# EAGLE board nRF9160 Thing Plus (EAGLE 9.6.2)
REV: C
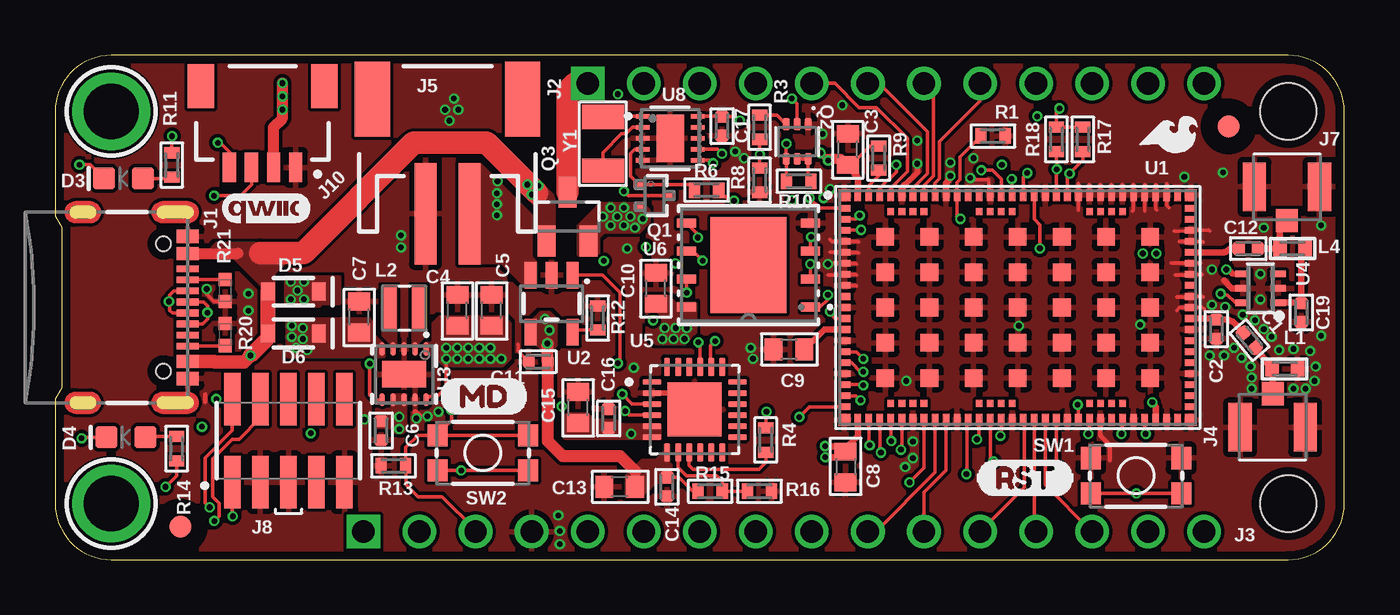
[diagram p3: board, top side]
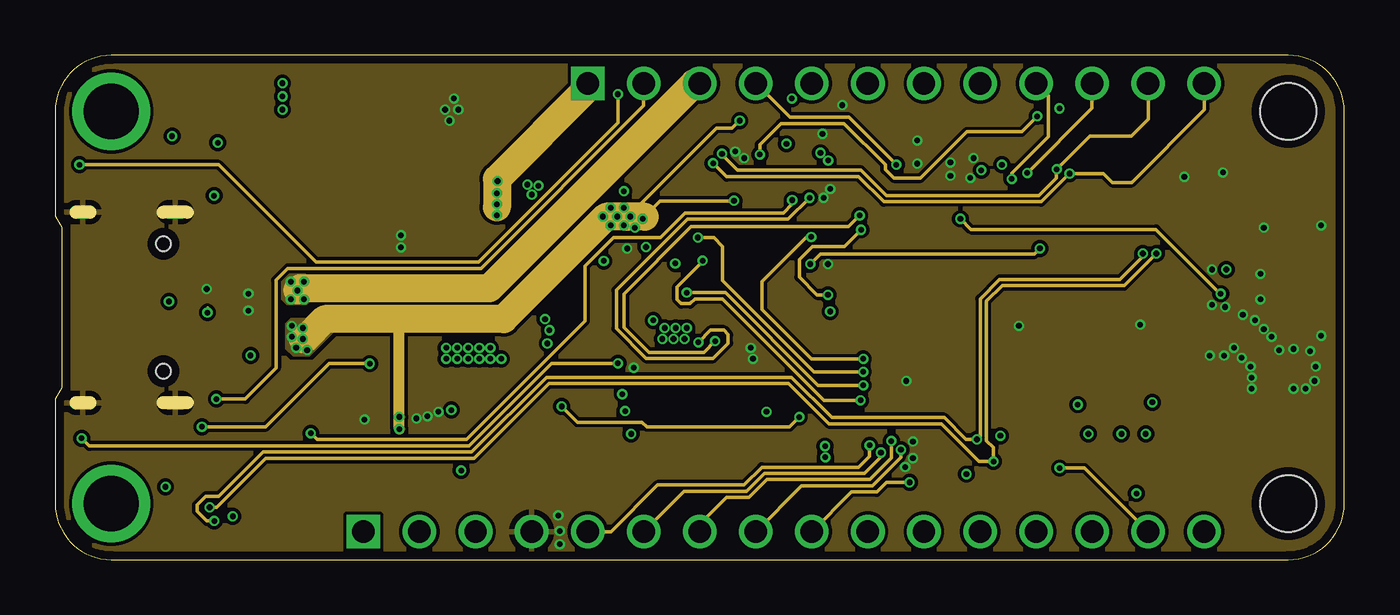
[diagram p4: board, inner layer Route2]
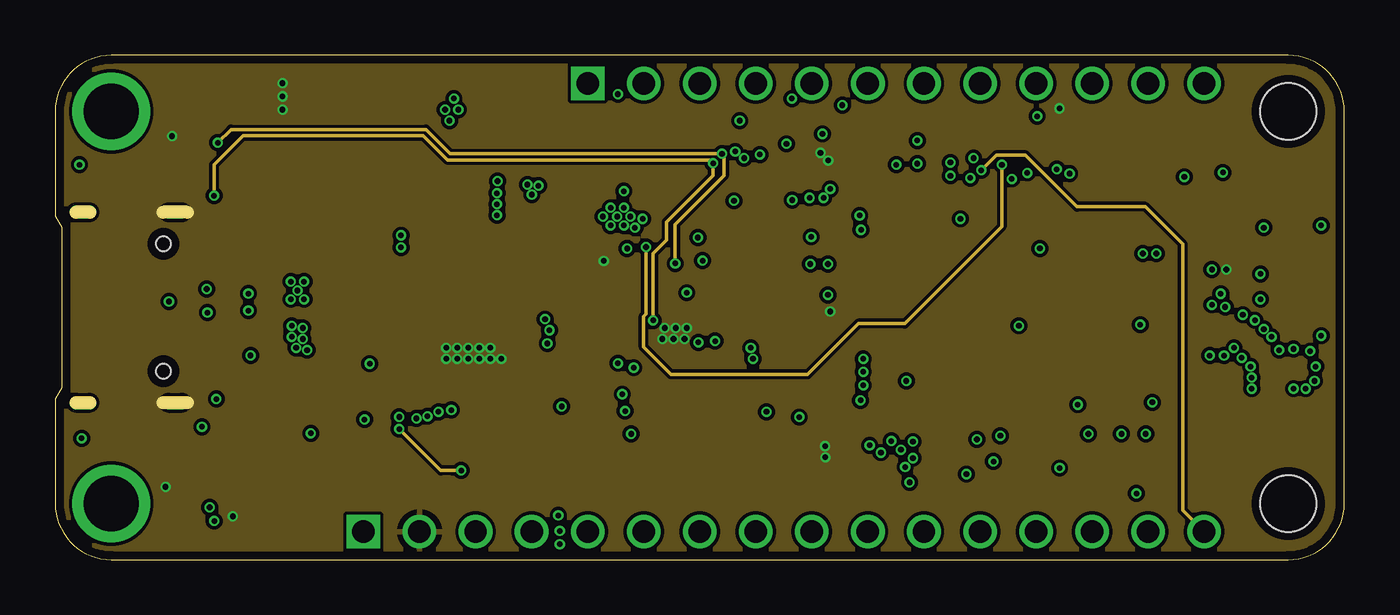
[diagram p5: board, inner layer Route15]
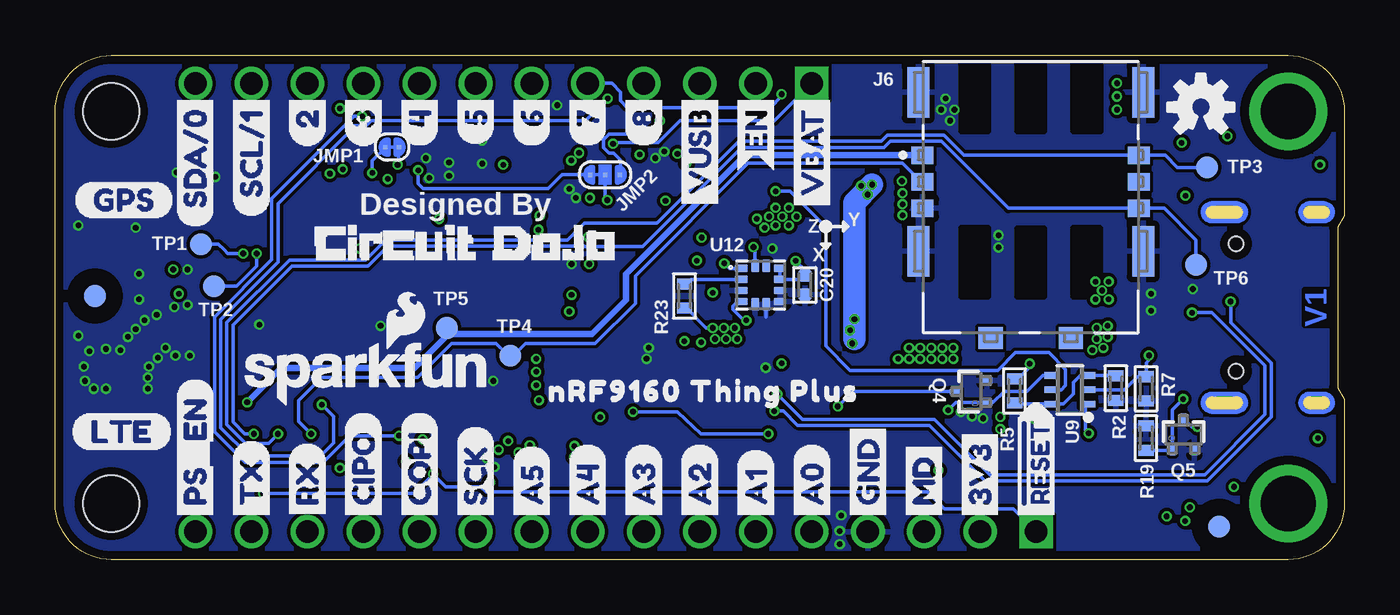
[diagram p6: board, bottom side, seen from below]

Size 58.42 x 22.86 mm. Coordinates in mm from the lower left corner, seen from the top.
Outline: 2.54,0 55.88,0 arc90 58.42,2.54 58.42,20.32 arc90 55.88,22.86 2.54,22.86 arc90 0,20.32 0,15.58 0.3,15.07 0.3,7.79 0,7.28 0,2.54 arc90 2.54,0
Copper layers (1*2*15*16): Top 0.035559375mm / dielectric 0.17018125mm / Route2 0.01778125mm / dielectric 47mil / Route15 0.01778125mm / dielectric 0.17018125mm / Bottom 0.035559375mm
Design rules "oshpark-4layer *": minimum track width 5mil, minimum drill 10mil, track to track 5mil, track to pad 5mil, pad to pad 5mil, via to via 5mil, smd to smd 5mil, copper to edge 15mil, drill to drill 6mil, minimum pad ring 4mil, minimum via ring 4mil, stop-mask expansion 2mil, vias tented up to drill 0.3mm, thermal gap 10mil
Net classes: 1 usb: width 0.15 mm; 2 rf: width 0.3 mm
Holes 2.54 mm at 55.88,20.32 55.88,2.54
tRestrict: area 28.6,5.3 to 29.4,5.5; area 27.5,6.4 to 27.7,7.2

## Footprints (pad centres in the part's own frame; a part is rotated, then mirrored left to right if it is on the bottom)
CAPC1005X55N = smd 0.54 x 0.6: 1 -0.43,0; 2 0.43,0
C0603 = smd 0.8 x 1: 1 -0.7,0; 2 0.7,0
LED-0603 = smd 1 x 1: A -0.877,0; C 0.877,0
SOD-323 = smd 0.63 x 0.83: A 1.15,0; C -1.15,0
USB-C-16P-2LAYER-PADS = smd 0.3 x 1: A5 -1.25,-0.34; A6 -0.25,-0.34; A7 0.25,-0.34; A8 1.25,-0.34; B5 1.75,-0.34; B6 0.75,-0.34; B7 -0.75,-0.34; B8 -1.75,-0.34 | smd 0.6 x 1: GND -3.225,-0.34; GND2 3.225,-0.34; VBUS1 -2.45,-0.34; VBUS2 2.45,-0.34 | drill 0.4 pad 0.6 long: SHLD1 -4.318,-0.915; SHLD2 4.318,-0.915; SHLD3 -4.318,-5.095; SHLD4 4.318,-5.095 | hole 0.65: -2.89,-1.445; 2.89,-1.445
CON-HEADER-1X12-MALE-PIN = drill 1.016 square: 1 0,0 | drill 1.016: 2 2.54,0; 3 5.08,0; 4 7.62,0; 5 10.16,0; 6 12.7,0; 7 15.24,0; 8 17.78,0; 9 20.32,0; 10 22.86,0; 11 25.4,0; 12 27.94,0
CON-HEADER-1X16-MALE-PIN = drill 1.016 square: 1 0,0 | drill 1.016: 2 2.54,0; 3 5.08,0; 4 7.62,0; 5 10.16,0; 6 12.7,0; 7 15.24,0; 8 17.78,0; 9 20.32,0; 10 22.86,0; 11 25.4,0; 12 27.94,0; 13 30.48,0; 14 33.02,0; 15 35.56,0; 16 38.1,0
TE_1909763-1 = smd 1 x 1.05: 1 0,-1.525 | smd 1.05 x 2.2: 2 -1.475,0; 3 1.475,0
JST-2-SMD = smd 1 x 4.6: 1 -1,-3.7; 2 1,-3.7 | smd 1.6 x 3.4: NC1 -3.4,1.5; NC2 3.4,1.5
MOLEX_104224-0820 = smd 1 x 2.3: G1 -5.1,1.5; G2 -5.1,8.7; G3 5.1,8.7; G4 5.1,1.5 | smd 1.1 x 1: R1 -1.82,12.625; R2 1.82,12.625 | smd 1 x 0.8: S1 4.9,4.35; S2 4.9,5.55; S3 -4.9,4.35; S4 4.9,6.75; S5 -4.9,5.55; S6 -4.9,6.75
SAMTEC_FTSH-105-XX-X-DV = smd 0.74 x 2.38: 1 -2.54,-1.88; 2 -2.54,1.88; 3 -1.27,-1.88; 4 -1.27,1.88; 5 0,-1.88; 6 0,1.88; 7 1.27,-1.88; 8 1.27,1.88; 9 2.54,-1.88; 10 2.54,1.88
JST04_1MM_RA = smd 0.6 x 1.35: 1 -1.5,0; 2 -0.5,0; 3 0.5,0; 4 1.5,0 | smd 1.2 x 2: NC1 2.8,-3.675; NC2 -2.8,-3.675
JUMPER-ROUND-NC = smd 0.2 x 0.2: P$1 -0.3,0; P$2 0.3,0
JUMPER-ROUND-3-NO-R = smd 0.2 x 0.2: P$1 -0.675,0; P$2 0,0; P$3 0.675,0
IND0402_22N_TAI = smd 0.61 x 0.711: 1 -0.572,0; 2 0.572,0
IND-2P0X2P0X1P2 = smd 0.65 x 2: P$1 -0.675,0; P$2 0.675,0
DIO_RB558WMF-L = smd 0.254 x 0.483: 1 -0.5,-0.711; 2 0.5,-0.711; 3 0,0.711
SOT50P160X60-6N = smd 0.56 x 0.32: 1 -0.785,0.5; 2 -0.785,0; 3 -0.785,-0.5; 4 0.785,-0.5; 5 0.785,0; 6 0.785,0.5
SOT23 = smd 0.8 x 1.4: 1 -0.95,-1.1; 2 0.95,-1.1; 3 0,1.1
R0402-M = smd 0.5 x 0.7: 1 -0.55,0; 2 0.55,0
0402-TIGHT = smd 0.6 x 0.6: 1 -0.5,0; 2 0.5,0
TACTILE_SWITCH_SMD_4.6X2.8MM = smd 0.9 x 1: 1 -2.05,-0.8; 2 2.05,-0.8; 3 2.05,0.8; 4 -2.05,0.8
TP-1P0 = smd 1 x 1: TP 0,0
NORDIC_NRF9160-SICA-R = smd 0.54 x 0.54: 1 -7.845,5.095; 21 -7.845,-5.095; 52 7.845,-5.095; 72 7.845,5.095 | smd 0.54 x 0.3: 2 -7.845,4.5; 3 -7.845,4; 4 -7.845,3.5; 5 -7.845,3; 6 -7.845,2.5; 7 -7.845,2; 8 -7.845,1.5; 9 -7.845,1; 10 -7.845,0.5; 11 -7.845,0; 12 -7.845,-0.5; 13 -7.845,-1; 14 -7.845,-1.5; 15 -7.845,-2; 16 -7.845,-2.5; 17 -7.845,-3; 18 -7.845,-3.5; 19 -7.845,-4; 20 -7.845,-4.5; 53 7.845,-4.5; 54 7.845,-4; 55 7.845,-3.5; 56 7.845,-3; 57 7.845,-2.5; 58 7.845,-2; 59 7.845,-1.5; 60 7.845,-1; 61 7.845,-0.5; 62 7.845,0; 63 7.845,0.5; 64 7.845,1; 65 7.845,1.5; 66 7.845,2; 67 7.845,2.5; 68 7.845,3; 69 7.845,3.5; 70 7.845,4; 71 7.845,4.5 | smd 0.3 x 0.54: 22 -7.25,-5.095; 23 -6.75,-5.095; 24 -6.25,-5.095; 25 -5.75,-5.095; 26 -5.25,-5.095; 27 -4.75,-5.095; 28 -4.25,-5.095; 29 -3.75,-5.095; 30 -3.25,-5.095; 31 -2.75,-5.095; 32 -2.25,-5.095; 33 -1.75,-5.095; 34 -1.25,-5.095; 35 -0.75,-5.095; 36 -0.25,-5.095; 37 0.25,-5.095; 38 0.75,-5.095; 39 1.25,-5.095; 40 1.75,-5.095; 41 2.25,-5.095; 42 2.75,-5.095; 43 3.25,-5.095; 44 3.75,-5.095; 45 4.25,-5.095; 46 4.75,-5.095; 47 5.25,-5.095; 48 5.75,-5.095; 49 6.25,-5.095; 50 6.75,-5.095; 51 7.25,-5.095; 73 7.25,5.095; 74 6.75,5.095; 75 6.25,5.095; 76 5.75,5.095; 77 5.25,5.095; 78 4.75,5.095; 79 4.25,5.095; 80 3.75,5.095; 81 3.25,5.095; 82 2.75,5.095; 83 2.25,5.095; 84 1.75,5.095; 85 1.25,5.095; 86 0.75,5.095; 87 0.25,5.095; 88 -0.25,5.095; 89 -0.75,5.095; 90 -1.25,5.095; 91 -1.75,5.095; 92 -2.25,5.095; 93 -2.75,5.095; 94 -3.25,5.095; 95 -3.75,5.095; 96 -4.25,5.095; 97 -4.75,5.095; 98 -5.25,5.095; 99 -5.75,5.095; 100 -6.25,5.095; 101 -6.75,5.095; 102 -7.25,5.095 | smd 0.8 x 0.8: 103_1 -6,3.2; 103_2 -4,3.2; 103_3 -2,3.2; 103_4 0,3.2; 103_5 2,3.2; 103_6 4,3.2; 103_7 6,3.2; 103_8 -6,1.6; 103_9 -4,1.6; 103_10 -2,1.6; 103_11 0,1.6; 103_12 2,1.6; 103_13 4,1.6; 103_14 6,1.6; 103_15 -6,0; 103_16 -4,0; 103_17 -2,0; 103_18 0,0; 103_19 2,0; 103_20 4,0; 103_21 6,0; 103_22 -6,-1.6; 103_23 -4,-1.6; 103_24 -2,-1.6; 103_25 0,-1.6; 103_26 2,-1.6; 103_27 4,-1.6; 103_28 6,-1.6; 103_29 -6,-3.2; 103_30 -4,-3.2; 103_31 -2,-3.2; 103_32 0,-3.2; 103_33 2,-3.2; 103_34 4,-3.2; 103_35 6,-3.2 | smd 0.3 x 0.3: 104 -5.75,-4.35; 105 -5.25,-4.35; 106 -4.75,-4.35; 107 -4.25,-4.35; 108 -1.75,-4.35; 109 -1.25,-4.35; 110 -0.75,-4.35; 111 -0.25,-4.35; 112 3.25,-4.35; 113 3.75,-4.35; 114 4.25,-4.35; 115 4.75,-4.35; 116 4.75,4.35; 117 4.25,4.35; 118 3.75,4.35; 119 3.25,4.35; 120 -0.25,4.35; 121 -0.75,4.35; 122 -1.25,4.35; 123 -1.75,4.35; 124 -4.25,4.35; 125 -4.75,4.35; 126 -5.25,4.35; 127 -5.75,4.35
SOT23-5 = smd 0.55 x 1.2: 1 -0.95,-1.3; 2 0,-1.3; 3 0.95,-1.3; 4 0.95,1.3; 5 -0.95,1.3
DSK0010A = smd 0.6 x 0.25: 1 -1.15,1; 2 -1.15,0.5; 3 -1.15,0; 4 -1.15,-0.5; 5 -1.15,-1; 6 1.15,-1; 7 1.15,-0.5; 8 1.15,0; 9 1.15,0.5; 10 1.15,1 | smd 1.2 x 2: 11 0,0
SOT363 = smd 0.3 x 0.7: 1 -0.65,-0.8; 2 0,-0.8; 3 0.65,-0.8; 4 0.65,0.8; 5 0,0.8; 6 -0.65,0.8
QFN50P400X400X80-25N = smd 0.84 x 0.26: 1 -1.935,1.25; 2 -1.935,0.75; 3 -1.935,0.25; 4 -1.935,-0.25; 5 -1.935,-0.75; 6 -1.935,-1.25; 13 1.935,-1.25; 14 1.935,-0.75; 15 1.935,-0.25; 16 1.935,0.25; 17 1.935,0.75; 18 1.935,1.25 | smd 0.26 x 0.84: 7 -1.25,-1.935; 8 -0.75,-1.935; 9 -0.25,-1.935; 10 0.25,-1.935; 11 0.75,-1.935; 12 1.25,-1.935; 19 1.25,1.935; 20 0.75,1.935; 21 0.25,1.935; 22 -0.25,1.935; 23 -0.75,1.935; 24 -1.25,1.935 | smd 2.45 x 2.45: 25 0,0
WIN_ZP-8-L = smd 0.86 x 0.403: 1 -2.818,1.905; 2 -2.818,0.635; 3 -2.818,-0.635; 4 -2.818,-1.905; 5 2.818,-1.905; 6 2.818,-0.635; 7 2.818,0.635; 8 2.818,1.905 | smd 3.454 x 4.343: 9 0,0
DFN10_2P7X2P7-L = smd 0.61 x 0.203: 1 -1.245,1; 2 -1.245,0.5; 3 -1.245,0; 4 -1.245,-0.5; 5 -1.245,-1; 6 1.245,-1; 7 1.245,-0.5; 8 1.245,0; 9 1.245,0.5; 10 1.245,1 | smd 1.245 x 2.159: 11 0,0
PQFN50P200X200100-12N = smd 0.575 x 0.35: 1 -0.875,0.75; 2 -0.875,0.25; 3 -0.875,-0.25; 4 -0.875,-0.75; 7 0.875,-0.75; 8 0.875,-0.25; 9 0.875,0.25; 10 0.875,0.75 | smd 0.35 x 0.575: 5 -0.25,-0.875; 6 0.25,-0.875; 11 0.25,0.875; 12 -0.25,0.875
FIDUCIAL-1MM = smd 1 x 1: 1 0,0
MOUNTING-HOLE-2.5MM-PLATED = drill 2.5 pad 3.2: P$1 0,0
XTAL320X150X90 = smd 1.092 x 1.905: 1 -1.219,0; 2 1.219,0

## Placement (x,y rotation side)
C1  15p  [CAPC1005X55N]  54.12,9.95 130 top
C2  15p  [CAPC1005X55N]  52.62,10.45 270 top
C3  4.7u  [C0603]  35.92,18.6 90 top
C4  10u  [C0603]  18.23,11.3 90 top
C5  10u  [C0603]  19.78,11.3 90 top
C6  0.1u  [CAPC1005X55N]  14.77,5.85 270 top
C7  10u  [C0603]  13.78,11 90 top
C8  4.7u  [C0603]  35.82,4.2 270 top
C9  4.7u  [C0603]  33.25,9.53 180 top
C10  4.7u  [C0603]  27.22,12.3 90 top
C11  1u  [CAPC1005X55N]  21.89,8.97 180 top
C12  56p  [CAPC1005X55N]  54.07,14.1 0 top
C13  4.7u  [C0603]  25.58,3.3 180 top
C14  0.1u  [CAPC1005X55N]  27.72,3.3 270 top
C15  4.7u  [C0603]  23.7,6.9 90 top
C16  0.1u  [CAPC1005X55N]  25.08,6.4 90 top
C17  0.1u  [CAPC1005X55N]  30.22,19.65 270 top
C19  56p  [CAPC1005X55N]  56.47,11.2 270 top
C20  0.1u  [CAPC1005X55N]  24.45,12.45 270 bottom
D3  BLUE  [LED-0603]  3.1,17.28 180 top
D4  Yellow  [LED-0603]  3.2,5.55 180 top
D5  1A/23V/620mV  [SOD-323]  10.8,12.15 180 top
D6  1A/23V/620mV  [SOD-323]  10.8,10.25 180 top
J1  USB Female C  [USB-C-16P-2LAYER-PADS]  6.35,11.43 270 top
J2  CON-HEADER-1X12-MALE-PIN  [CON-HEADER-1X12-MALE-PIN]  24.13,21.59 0 top
J3  CON-HEADER-1X16-MALE-PIN  [CON-HEADER-1X16-MALE-PIN]  13.97,1.27 0 top
J4  CON-1909763-1  [TE_1909763-1]  55.17,6 180 top
J5  [JST-2-SMD]  17.78,19.38 0 top
J6  CON-SIM-104224-0820  [MOLEX_104224-0820]  14.21,22.68 180 bottom
J7  CON-1909763-1  [TE_1909763-1]  55.82,16.9 0 top
J8  CON-FTSH-105-XX-X-DV  [SAMTEC_FTSH-105-XX-X-DV]  10.57,5.39 0 top
J10  QWIIC_RIGHT_ANGLE  [JST04_1MM_RA]  9.4,17.78 180 top
JMP1  JUMPER-NC  [JUMPER-ROUND-NC]  43.15,18.7 180 bottom
JMP2  JUMPER-3/1  [JUMPER-ROUND-3-NO-R]  33.5,17.45 180 bottom
L1  39n  [IND0402_22N_TAI]  55.72,8.65 180 top
L2  1.5u  [IND-2P0X2P0X1P2]  15.82,11.4 0 top
L4  68n  [IND0402_22N_TAI]  56.07,14.1 180 top
LOGO5  OSHW-LOGOS  [OSHW-LOGO-S]  6.5,20.52 0 bottom
PCB1  PCB-NRF91-FEATHER  [PLACEHOLDER]  -12.93,-5.08 0 top  (outside the outline)
Q1  MOSFET-P-SC89  [DIO_RB558WMF-L]  27.17,16.5 270 top
Q2  MOSFET-DUAL-COMP-SOT563  [SOT50P160X60-6N]  33.62,18.95 270 top
Q3  MOSFET-P-20V-4.7A-SOT23  [SOT23]  23.22,15.55 0 top
Q4  MOSFET-N-SC89  [DIO_RB558WMF-L]  16.91,7.62 90 bottom
Q5  MOSFET-N-SC89  [DIO_RB558WMF-L]  7.29,5.68 0 bottom
R1  100k  [R0402-M]  42.5,19.2 180 top
R2  1M  [R0402-M]  10.36,7.77 90 bottom
R3  100k  [R0402-M]  31.92,19.6 90 top
R4  1k  [R0402-M]  32.2,5.42 90 top
R5  100k  [R0402-M]  14.95,7.65 270 bottom
R6  100k  [R0402-M]  29.52,16.75 0 top
R7  100k  [R0402-M]  8.98,7.74 90 bottom
R8  100k  [R0402-M]  31.92,17.2 90 top
R9  1M  [R0402-M]  37.32,18.2 90 top
R10  100k  [R0402-M]  33.7,17.15 180 top
R11  330  [R0402-M]  5.28,17.89 90 top
R12  2k  [R0402-M]  24.58,10.95 270 top
R13  100k  [R0402-M]  15.33,4.25 0 top
R14  330  [R0402-M]  5.51,5.03 270 top
R15  22k  [R0402-M]  29.68,3.1 180 top
R16  33k  [R0402-M]  31.92,3.1 180 top
R17  10k  [R0402-M]  46.57,19.05 90 top
R18  10k  [R0402-M]  45.37,19.05 90 top
R19  1M  [R0402-M]  8.99,5.5 270 bottom
R20  5.1k  [0402-TIGHT]  7.7,10.2 270 top
R21  5.1k  [0402-TIGHT]  7.7,12.2 90 top
R23  100k  [R0402-M]  29.9,11.95 270 bottom
SW1  MOMENTARY-SWITCH-SPST-SMD-4.6X2.8MM  [TACTILE_SWITCH_SMD_4.6X2.8MM]  48.98,3.8 0 top
SW2  MOMENTARY-SWITCH-SPST-SMD-4.6X2.8MM  [TACTILE_SWITCH_SMD_4.6X2.8MM]  19.38,4.84 0 top
TP1  TP-1SIDE-1P0  [TP-1P0]  51.82,14.3 0 bottom
TP2  TP-1SIDE-1P0  [TP-1P0]  51.22,12.4 0 bottom
TP3  TP-1SIDE-1P0  [TP-1P0]  6.23,17.78 0 bottom
TP4  TP-1SIDE-1P0  [TP-1P0]  37.8,9.24 0 bottom
TP5  TP-1SIDE-1P0  [TP-1P0]  40.67,10.5 0 bottom
TP6  TP-1SIDE-1P0  [TP-1P0]  6.72,13.37 270 bottom
U1  MOD-NRF9160-SICA-R  [NORDIC_NRF9160-SICA-R]  43.62,11.43 0 top
U2  MCP73831  [SOT23-5]  22.5,11.6 180 top
U3  IC-TPS63031DSKR  [DSK0010A]  15.82,8.4 270 top
U4  POWER-SWITCH-MIC94092YC6  [SOT363]  54.62,12.3 90 top
U5  IC-CP2102N-A02-GQFN24R  [QFN50P400X400X80-25N]  28.98,6.8 0 top
U6  FLASH-WSON  [WIN_ZP-8-L]  31.42,13.35 180 top
U8  IC-PCF85063ATL/1  [DFN10_2P7X2P7-L]  27.87,19.1 0 top
U9  IC-BAV70S  [SOT363]  12.44,7.7 90 bottom
U12  IC-LIS2DH12TR  [PQFN50P200X200100-12N]  26.45,12.45 0 bottom
U$1  [SFE_LOGO_NAME_FLAME_.1]  44.27,8.44 0 bottom
U$2  [LOGO-CIRCUITDOJO]  46.9,13.19 0 bottom
U$3  FIDUCIAL-1MM  [FIDUCIAL-1MM]  56.62,11.95 0 bottom
U$4  FIDUCIAL-1MM  [FIDUCIAL-1MM]  5.67,1.5 0 bottom
U$5  [A3L-LOC]  -164.72,-120.13 0 top  (outside the outline)
U$6  [QWIIC_4MM]  9.57,15.92 0 top
U$7  [RST0]  41.7,3.7 0 top
U$8  [PS_EN0]  52.07,1.55 90 bottom
U$9  [MD0]  17.4,7.4 0 top
U$10  [20]  46.99,18.66 90 bottom
U$11  [30]  44.45,18.66 90 bottom
U$12  [SCL#11]  49.53,15.52 90 bottom
U$13  [SDA#00]  52.07,15.04 90 bottom
U$14  [MD0]  19.05,1.55 90 bottom
U$15  [SFE_LOGO_FLAME_.1]  50.65,19.15 315 top
U$16  [TX0]  49.53,1.55 90 bottom
U$17  [RX0]  46.99,1.55 90 bottom
U$18  [SCK0]  39.37,1.55 90 bottom
U$19  [CIPO0]  44.45,1.55 90 bottom
U$20  [COPI0]  41.91,1.55 90 bottom
U$21  [GPS0]  57.6,16.3 0 bottom
U$22  [LTE0]  57.7,5.8 0 bottom
U$23  [NRF9160_THING_PLUS0]  29.03,7.64 0 bottom
U$24  FIDUCIAL-1MM  [FIDUCIAL-1MM]  5.67,1.5 0 top
U$31  MOUNTING-HOLE-2.5MM-PLATED  [MOUNTING-HOLE-2.5MM-PLATED]  2.54,20.32 270 top
U$32  MOUNTING-HOLE-2.5MM-PLATED  [MOUNTING-HOLE-2.5MM-PLATED]  2.54,2.54 270 top
U$35  FIDUCIAL-1MM  [FIDUCIAL-1MM]  53.17,19.63 270 top
U$69  [GND12]  21.59,1.55 90 bottom
U$71  [3V314]  16.51,1.51 90 bottom
U$72  [#RESET15]  13.97,1.4 90 bottom
U$73  [VUSB25]  29.21,15.63 90 bottom
U$74  [EN26]  26.67,17.58 90 bottom
U$75  [VBAT27]  24.13,15.58 90 bottom
U$83  [A56]  36.83,1.55 90 bottom
U$84  [A47]  34.29,1.56 90 bottom
U$85  [A38]  31.75,1.52 90 bottom
U$86  [A29]  29.21,1.51 90 bottom
U$87  [A110]  26.67,1.56 90 bottom
U$88  [A011]  24.13,1.51 90 bottom
U$89  [412]  41.91,18.66 90 bottom
U$90  [513]  39.37,18.75 90 bottom
U$91  [614]  36.83,18.7 90 bottom
U$92  [715]  34.29,18.7 90 bottom
U$93  [816]  31.75,18.71 90 bottom
Y1  XTAL-ABS07AIG-32.768KHZ-7-T  [XTAL320X150X90]  24.82,18.85 90 top

## Tracks (layer width: path | path; a pad name or v marks a point on that pad's centre or on a via)
!EN  (via drill 0.25)
  Route2 0.152: J2.2 26.67,20.57 19.3,13.2 10.54,13.2 10.01,12.67 10.01,8.68 8.61,7.28 v7.3,7.28
  Bottom 0.152: R19.2 7.8,4.96 Q5.1 7.79,6.79 v7.3,7.28
!RESET  (via drill 0.25)
  Top 0.152: U1.32 41.32,6.38 41.32,3.9 v41.3,3.88 | SW1.1 v49,3 SW1.2
  Bottom 0.152: J3.1 15.01,2.31 18.13,2.31 18.9,3.08 38.53,3.08 38.54,3.07 38.9,3.07 39.14,3.31 40.73,3.31 v41.3,3.88 42.17,3 48.98,3 v48.99,3 v49,3
+3V3  (via drill 0.25)
  Top 0.152: C3.1 36.02,17.85 36.92,18.75 R9.2 | 5.43,18.59 R11.2 5.28,19.18 v5.3,19.2 | U1.12 35.34,10.93 35.12,11.15 v35.12,11.25 | R17.2 R18.2 45.37,20.31 v45.51,20.45 | R14.2 5.51,3.81 v5,3.3 | U3.10 16.97,7.4 17.3,7.4 17.72,7.82 v17.72,9.1 | J8.1 8.03,1.98 v8.05,1.96
  Top 0.203: C8.1 35.84,5.08
  Top 0.254: v53.07,13.15 53.17,13.15 53.37,12.95 U4.4
  Top 0.305: U1.102 36.37,17.3 C3.1 35.41,18.09 v35.03,18.09 | v34.68,18.44 34.87,18.25 35.62,18.25 36.02,17.85 | v34.89,5.14 35.58,5.14 C8.1 35.56,4.64 v34.9,4.64 | U1.22 36.37,5.6 35.84,5.08
  Top 0.508: J10.2 9.9,19.6 10.3,20 v10.3,20.4 v10.3,21 v10.3,21.6
  Bottom 0.152: U12.10 U12.9 24.63,12.7 C20.1 24.45,13.13 v24.86,13.54 | v28.62,10.5 28.92,10.5 29.82,11.4 R23.2
  other vias: 18.72,9.1 18.22,9.1 18.72,9.6 19.22,9.6 19.22,9.1 19.72,9.1 19.72,9.6 20.22,9.1 27.62,10.5 28.12,10.5 28.52,10 28.02,10 27.52,10 18.22,9.6 17.72,9.6
  pour Top (no thermals): 17.12,9.3 16.82,9.3 16.82,9.8 17.02,9.8 17.12,9.9 17.12,10.7 17.42,11 20.32,11 20.62,10.7 20.62,9.12 20.3,8.8 17.62,8.8
  pour Route15 (isolate 0.152, rank 2): 58.42,0 0,0 0,22.86 58.42,22.86
  pour Top (no thermals): 26.82,11.9 26.82,10.2 27.22,9.8 28.52,9.8 29.02,10.3 29.02,11.6 28.12,11.6 27.82,11.9
ANT
  Top 0.3: U1.61 52.57,10.93 C2.1 53.02,10.88 arc-49 53.5,10.66 arc3 C1.2
ANT_FILT
  Top 0.3: C1.1 55.05,8.75 L1.2 55.17,8.65 J4.1
CHRG  (via drill 0.25)
  Top 0.152: U2.1 24.8,12.9 25.6,12.1 25.6,9 v25.5,8.9 | v1.2,5.5 1.25,5.55 D4.C
  Route2 0.152: v25.5,8.9 22.5,8.9 18.75,5.15 1.55,5.15 v1.2,5.5 1.41,5.29
COEX0/LNA_EN  (via drill 0.25)
  Top 0.152: v41.02,15.45 40.87,15.45 U1.93 40.87,17.09 41,17.22 41,18.25 R1.2 | U4.6 53.47,11.65 53.12,12 52.82,12 v52.82,12.05
  Route2 0.152: v41.02,15.45 41.5,14.97 49.88,14.97 52.8,12.05 v52.82,12.05
CP212_VBUS
  Top 0.152: U5.8 28.23,4.17 28.6,3.8 30,3.8 30.23,3.57 R15.1 R16.2
CP2102N-!RST
  Top 0.152: R4.1 32.2,4.4 31.9,4.1 28.9,4.1 28.73,4.27 U5.9
CP2102N-VDD  (via drill 0.25)
  Top 0.152: R4.2 32.2,6.7 v32.23,6.7
  Bottom 0.152: v26.1,5.7 29.15,5.7 30.21,6.69 v32.22,6.69 v32.23,6.7
  pour Top (no thermals): 27.4,6.1 25.6,6.1 25.4,6.3 24.4,6.3 24.1,6.6 23.1,6.6 23.1,5.5 27.4,5.5
DIFF_N  (via drill 0.25)
  Top 0.152: J1.B7 5.38,12.18 5.2,12 5.2,11.7 | 5.2,11.7 5.2,11.3 5.32,11.18 J1.A7 | 5.2,11.7 v5.15,11.7 | U5.4 26.01,6.55 v25.83,6.74
  Bottom 0.152: v25.83,6.74 25.43,6.74 24.78,6.09 18.8,6.09 16.29,3.57 6.21,3.57 3.32,6.46 3.32,8.92 5.15,10.75 v5.15,11.7
DIFF_P  (via drill 0.25)
  Top 0.152: J1.A6 6.72,11.68 6.9,11.5 v6.9,11.2 6.9,10.9 6.68,10.68 J1.B6 | U5.3 26.15,7.05 v25.7,7.5
  Route2 0.152: v6.9,11.2 6.9,11.4
  Bottom 0.152: v25.7,7.5 24.57,6.37 18.59,6.37 16.07,3.85 6.33,3.85 3.6,6.58 3.6,8.8 6,11.2 v6.9,11.2
FLASH_CS  (via drill 0.25)
  Top 0.152: U1.4 36.5,14.93 v36.52,14.95 | v35.02,12 35.02,11.8 34.66,11.45 U6.1
  Route2 0.152: v36.52,14.95 35.77,14.2 34.32,14.2 33.72,13.6 33.72,12.8 34.52,12 v35.02,12
FLASH_HOLD  (via drill 0.25)
  Top 0.152: U1.18 36.59,7.93 v36.62,7.9 | U6.7 28.6,12.12 v28.62,12.1
  Route2 0.152: v36.62,7.9 34.57,7.9 30.37,12.1 v28.62,12.1
FLASH_SCK  (via drill 0.25)
  Top 0.152: v36.5,7.22 36.29,7.43 U1.19 | U6.6 28.9,13.98 v29.34,13.55
  Route2 0.152: v29.34,13.55 29.34,13.52 28.19,12.37 28.19,11.78 28.37,11.6 28.77,11.6 28.99,11.82 30.25,11.82 34.85,7.22 v36.5,7.22
FLASH_SI  (via drill 0.25)
  Top 0.152: U6.5 29.13,14.73 v29.13,14.6 | v36.62,8.52 36.49,8.52 36.08,8.93 U1.16
  Route2 0.152: v36.62,8.52 36.05,8.52 35.86,8.52 34.38,8.52 30.25,12.65 30.25,14.2 29.85,14.6 29.77,14.6 29.7,14.6 v29.13,14.6
FLASH_SO  (via drill 0.25)
  Top 0.152: U1.86 44.37,15.43 44.62,15.18 v44.62,14.11 | U6.2 34.24,13.38 v34.22,13.4
  Route2 0.152: v34.22,13.4 34.67,13.85 44.37,13.85 v44.62,14.11
FLASH_WP  (via drill 0.25)
  Top 0.152: U1.15 35.89,9.41 36.31,9.41 v36.62,9.1 | v34.26,14.63 34.24,14.61 U6.3
  Route2 0.152: v34.26,14.63 34.06,14.63 32.04,12.62 32.04,11.33 34.27,9.1 v36.62,9.1
GND  (via drill 0.25)
  Top 0.152: 46.37,17.05 U1.82 46.37,15.85 | 50.37,17.05 U1.74 50.37,16.05 50.47,15.95 | 46.87,16.38 46.87,17 | 47.37,16.38 47.37,17 | 47.87,16.38 47.87,17 | 48.37,16.38 U1.78 48.37,17 | 48.87,16.38 48.87,17 | 49.37,16.38 49.37,17 | 49.87,16.38 49.87,17 | 50.57,13.45 51.35,13.45 U1.66 51.39,13.45 51.92,13.45 | 50.77,12.9 51.34,12.9 U1.65 51.99,12.93 | 50.82,11.9 51.34,11.9 U1.63 51.99,11.93 52.02,11.9 | 50.82,11.3 50.95,11.43 U1.62 51.99,11.43 52.07,11.35 | U1.77 48.87,15.85 48.82,15.8 | U1.76 49.37,15.8 | U1.75 49.87,15.9 49.92,15.85 | U1.90 42.32,16.57 42.32,17.2 42.3,17.22 41.54,17.22 v41.47,17.29 v41.47,17.3 | 50.72,14.9 51.44,14.9 U1.69 52.29,14.93 52.32,14.9 | 52.02,14.4 51.99,14.43 U1.68 50.95,14.43 | 36.42,14.4 36.39,14.43 U1.5 35.19,14.43 35.12,14.5 | U1.6 36.39,13.93 36.42,13.9 | 36.32,13.4 36.29,13.43 U1.7 35.64,13.43 35.62,13.45 | 36.32,12.9 36.29,12.93 U1.8 35.74,12.9 35.02,12.9 | U1.9 36.29,12.43 36.32,12.4 | 35.72,13.95 35.12,13.95 | 35.72,13.45 35.62,13.45 | 35.62,13.45 35.12,13.45 | R21.1 7.2,11.7 6.87,12.03 v6.87,12.27 | C11.2 20.98,9.45 20.98,9.75
  Top 0.2: J1.GND2 6.01,7.2 5.92,7.11 J1.SHLD2 | 6.79,7.14 6.79,7.49
  Top 0.203: 28.7,6.8 U5.25 | 47.8,4.5 47.8,5.17 47.56,5.4 47.56,5.43 47.37,5.63 U1.44
  Top 0.254: 16.32,6.7 16.52,6.5 | 38.51,16.99 39.07,17.55 v39.07,17.95 | U5.2 27.95,7.55 28.7,6.8
  Top 0.3: 52.47,13.15 v52.42,13.15 | 52.98,12.64 53.32,12.3 U4.5
  Top 0.305: U1.98 38.37,16.85 38.51,16.99 | U1.94 40.37,17.06 40.48,17.17 40.48,17.31 v40.57,17.4
  Bottom 0.152: U12.6 26.2,11
  other vias: 39.07,19 35.67,20.6 34.77,19.3 34.82,16.4 35.12,16.8 15.67,14.7 15.67,14.15 38.87,5.35 38.87,4.6 38.52,4.2 53.42,9.6 52.97,9.25 53.77,9.15 56.12,7.75 52.92,17.55 51.17,17.35 54.22,7.75 54.17,8.75 40.57,18 41.62,18.2 54.62,12.95 54.62,11.8 52.32,9.25 56.67,7.75 56.12,9.55 56.87,9.45 57.12,8.75 57.07,8.1 55.47,9.5 55.12,10.1 54.77,10.45 54.37,10.85 53.82,11.1 53.02,11.45 52.42,11.55 57.37,10.15 54.22,8.25 57.37,15.15 54.77,15.05 35.02,13.4 38.57,8.1 22.87,1.3 22.8,2 22.87,0.7 18.27,20.4 18.07,20.9 17.87,19.9 17.67,20.4 16.37,6.4 16.87,6.5 17.37,6.7 14.02,6.35 43.67,10.6 49.17,10.65 31.22,18.2 30.82,18.5 31.52,9.6 31.62,9.1 25.92,14.1 26.22,8.7 8.76,12.06 8.76,11.29
  pour Top (isolate 0.152, rank 2): 0,22.86 0,0 58.42,0 58.42,22.86
  pour Bottom (isolate 0.152, rank 2): 58.42,0 0,0 0,22.86 58.42,22.86
  pour Route2 (isolate 0.152, rank 2): 0,22.86 0,0 58.42,0 58.42,22.86
GPS
  Top 0.3: C12.1 53.37,14.1 arc39 53.17,14.03 arc-49 52.77,13.93 U1.67
GPS_ANT
  Top 0.3: J7.1 55.5,15.05 L4.2 C12.2
LNA_SW_OUT
  Top 0.254: 56.73,14.01 56.73,13.99
  Top 0.3: U4.1 56.45,11.65 C19.1 56.47,13.73 56.73,13.99 | L4.1 56.73,14.01
MODE/WAKE  (via drill 0.25)
  Top 0.152: SW2.3 SW2.4 17.29,5.64 | 17.29,5.64 16.44,5.64 15.88,5.08 R13.2 15.91,4.4 15.91,3.39 | J3.3 19.05,1.34 17.54,2.85 16.45,2.85 15.91,3.39 | 15.9,3.4 15.91,3.39 | v17.95,6.78 17.95,6.3 17.29,5.64
  Bottom 0.152: U9.4 13.66,8.35 14.38,7.63 15.41,7.63 15.92,7.12 Q4.1 17.18,7.12 17.19,7.13 17.6,7.13 v17.95,6.78
N$1
  pour Top (no thermals): 15.42,9.7 15.42,12.35 14.87,12.35 14.87,10.15 15.32,9.7
N$2
  pour Top (no thermals): 16.32,9.7 16.77,10.15 16.77,12.35 16.22,12.35 16.22,9.8
N$3
  Top 0.152: J1.A5 6.03,12.7 R21.2
N$4
  Top 0.152: R9.1 37.32,17.4 36.87,16.95 U1.101
N$5
  Top 0.305: U1.13 34.85,10.43 C9.1
N$6
  Top 0.152: R3.2 32.7,20.15 Q2.3
N$7
  Top 0.152: Q2.5 Q2.6 34.12,17.28 R10.1
N$8
  Top 0.152: R11.1 5.22,17.28 D3.A
N$9
  Top 0.152: J1.B5 7.68,9.68 R20.2
N$10
  Top 0.152: U8.1 24.85,20.1 Y1.2
N$11
  Bottom 0.152: U12.2 29.6,12.7 29.8,12.5 R23.1
N$12  (via drill 0.25)
  Route15 0.152: v42.9,17.9 42.9,15.1 38.5,10.7 36.4,10.7 34.1,8.4 27.9,8.4 26.67,9.63 26.67,11.02 26.78,11.13 v26.78,14.17
  Bottom 0.152: U12.12 26.7,14.09 v26.78,14.17 | JMP1.P$1 42.85,17.95 v42.9,17.9
N$13
  Top 0.152: D4.A 4.11,5.58 R14.1
N$18
  Top 0.152: Y1.1 24.82,18.45 25.67,19.3 25.87,19.3 26.17,19.6 U8.2
NRF_PS_EN_JMP  (via drill 0.25)
  Route2 0.152: 33,15.71 28.53,15.71 27.43,14.6 25.3,14.6 24.01,13.31 24.01,10.81 18.64,5.44 11.87,5.44 v11.59,5.72 | 33,15.71 33.01,15.71 | 33,15.71 33.4,16.11 v33.4,16.3
  Bottom 0.152: JMP2.P$2 33.5,16.4 v33.4,16.3 | U9.1 11.74,6.95 11.74,5.88 v11.59,5.72
P0.00/D4
  Top 0.152: J2.8 41.91,20.79 40.08,18.96 40.08,17.27 39.87,17.06 U1.95
P0.01/D5
  Top 0.152: U1.96 39.37,16.95 39.8,17.38 39.8,21.16 J2.7
P0.02/D6
  Top 0.152: U1.97 38.87,16.85 39.52,17.5 39.52,19.4 37.33,21.59 J2.6
P0.03/D7  (via drill 0.25)
  Top 0.152: U1.99 37.87,16.85 38.62,17.6 38.62,19.1 37.22,20.5 36.42,20.5 35.33,21.59 J2.5 | D3.C 1.6,17.9 v1.1,17.9
  Route2 0.152: v1.1,17.9 7.4,17.9 11.82,13.48 19.18,13.48 25.5,19.8 v25.5,21.1
  Bottom 0.152: v25.5,21.1 25.5,21 26,20.5 32.5,20.5 32.8,20.8 32.8,21.2 33.19,21.59 J2.5
P0.04/D8  (via drill 0.25)
  Top 0.152: U1.100 37.37,16.85 37.72,17.2 37.75,17.2 38.12,17.56 v38.12,17.9
  Route2 0.152: v38.12,17.9 35.97,20.05 33.29,20.05 J2.4
P0.05/USB_UART_RX  (via drill 0.25)
  Top 0.152: U1.2 34.66,15.93 v34.19,16.4 | U5.21 29.23,9.77 v29.15,9.85
  Route2 0.152: v34.19,16.4 33.22,15.43 28.65,15.43 25.44,12.22 25.44,10.47 26.78,9.12 29.82,9.12 30.5,9.8 30.5,10.2 30.3,10.4 29.7,10.4 v29.15,9.85
P0.06/USB_UART_TX  (via drill 0.25)
  Top 0.152: U5.20 29.7,8.77 29.7,9.7 v29.91,9.9 | U1.3 36.29,15.43 v36.46,15.6
  Route2 0.152: v36.46,15.6 35.96,15.1 28.82,15.1 25.77,12.05 25.77,10.53 26.9,9.4 29.4,9.4 v29.91,9.9
P0.12/MD  (via drill 0.25)
  Top 0.152: U1.20 34.19,6.93 v33.72,6.46
  Route2 0.152: v33.72,6.46 33.28,6.02 26.81,6.02 26.6,6.23 23.67,6.23 v22.95,6.95
  Bottom 0.152: Q4.3 22.28,7.62 v22.95,6.95
P0.13/A0  (via drill 0.25)
  Top 0.152: U1.23 36.87,5.22 v36.91,5.18
  Route2 0.152: v36.91,5.18 36.91,4.69 36.41,4.19 32.02,4.19 31.21,3.38 27.3,3.38 25.19,1.27 J3.5
P0.14/A1  (via drill 0.25)
  Top 0.152: U1.24 37.37,4.9 v37.42,4.85
  Route2 0.152: J3.6 28.5,3.1 31.33,3.1 32.14,3.91 36.68,3.91 37.42,4.65 v37.42,4.85
P0.15/A2  (via drill 0.25)
  Top 0.152: U1.25 37.87,5.35 v37.89,5.38
  Route2 0.152: v37.89,5.38 37.89,4.6 36.92,3.63 32.25,3.63 31.45,2.82 30.42,2.82 29.21,1.61 J3.7
P0.16/A3  (via drill 0.25)
  Top 0.152: v38.33,4.98 38.37,5.03 U1.26
  Route2 0.152: v38.33,4.98 38.33,4.63 37.04,3.35 33.83,3.35 J3.8
P0.17/A4  (via drill 0.25)
  Top 0.152: U1.28 39.37,4.15 v38.72,3.5
  Route2 0.152: J3.9 36.08,3.06 37.23,3.06 37.67,3.5 v38.72,3.5
P0.18/A5
  Top 0.152: U1.29 39.87,3.95 37.19,1.27 J3.10
P0.19/SCK
  Top 0.152: U1.30 40.37,4.05 39.37,3.05 J3.11
P0.20/VBAT_MEAS  (via drill 0.25)
  Top 0.152: R8.2 R3.1 31.92,18.38 v31.93,18.36 | U1.35 42.87,5.65 v42.83,5.61
  Route2 0.152: v31.93,18.36 31.93,18.81 32.89,19.77 35.75,19.77 37.62,17.9 37.62,17.68 38,17.3 39.22,17.3 41.32,19.4 43.8,19.4 v44.5,20.1
  Bottom 0.152: v44.5,20.1 44.87,20.1 48.6,16.37 48.6,13.6 51.2,11 51.2,5.79 49.82,4.41 46.27,4.41 45.07,5.61 v42.83,5.61
P0.21/COPI
  Top 0.152: U1.37 43.92,6.38 43.92,3.28 J3.12
P0.22/CIPO
  Top 0.152: U1.38 44.37,1.35 J3.13
P0.23/RX
  Top 0.152: U1.39 44.87,3.39 J3.14
P0.24/TX  (via drill 0.25)
  Top 0.152: v45.52,4.15 45.37,4.3 U1.40
  Route2 0.152: v45.52,4.15 46.65,4.15 J3.15
P0.25/VBAT_MEAS_EN  (via drill 0.25)
  Top 0.152: U1.42 46.37,6.95 46.32,7 46.32,7.01 v46.34,7.03 | 33.62,19.75 Q2.2 33.62,20.67 v33.39,20.9
  Bottom 0.152: v33.39,20.9 34.39,19.9 44.09,19.9 44.32,19.67 44.8,19.67 | 44.8,19.67 44.91,19.67 | 44.8,19.67 48.32,16.15 48.32,13.48 50.92,10.88 50.92,5.98 49.63,4.69 46.39,4.69 45.8,5.28 45.8,6.49 v46.34,7.03
P0.26/SDA  (via drill 0.25)
  Top 0.152: U1.83 45.87,17.5 v45.97,17.5 46.57,18.1 R17.1 46.57,18.35 | v29.82,17.97 29.68,18.1 U8.6 | J10.3 8.9,17 8.4,16.5 v7.2,16.5
  Route2 0.152: J2.12 52.07,20.39 48.78,17.1 47.9,17.1 47.5,17.5 v45.97,17.5 44.69,16.22 37.55,16.22 36.41,17.36 30.42,17.36 v29.82,17.97
  Route15 0.152: v7.2,16.5 7.2,17.9 8.52,19.22 16.68,19.22 17.78,18.12 29.66,18.12 v29.82,17.97 29.82,17.41 27.71,15.31 27.71,14.49 27.1,13.88 v27.1,10.84
  Bottom 0.152: U12.4 27.5,11.7 27.7,11.5 27.7,11.34 27.2,10.84 v27.1,10.84
P0.27/SCL  (via drill 0.25)
  Top 0.152: U1.84 45.37,17.68 v45.39,17.7 45.39,17.72 R18.1 | U8.7 30.02,18.6 v30.22,18.4 | v7.37,18.9 7.47,18.9 7.9,18.47 J10.4
  Route2 0.152: v30.22,18.4 30.22,18.35 30.92,17.65 36.52,17.65 37.67,16.5 44.58,16.5 45.37,17.3 45.37,17.7 v45.39,17.7 46.89,19.2 48.76,19.2 49.53,19.97 J2.11
  Route15 0.152: v7.37,18.9 7.97,19.5 16.8,19.5 17.9,18.4 v30.22,18.4 30.3,18.32 30.3,17.4 28.1,15.2 v28.1,13.43
  Bottom 0.152: v28.1,13.43 27.87,13.2 U12.1
P0.29/D2  (via drill 0.25)
  Top 0.152: v44.05,17.53 43.87,17.35 U1.87
  Route2 0.152: J2.10 46.99,20.47 v44.05,17.53
  Bottom 0.152: v44.05,17.53 44.05,18.08 43.45,18.68 JMP1.P$2
P0.30/D3  (via drill 0.25)
  Top 0.152: v43.35,17.26 43.35,16.54 U1.88
  Route2 0.152: v43.35,17.26 43.35,17.53 45,19.18 45,21.04 J2.9
P0.31/NRF_PS_EN  (via drill 0.25)
  Top 0.152: v41.97,17.65 42.47,17.65 42.87,17.25 U1.89
  Route15 0.152: J3.16 51.1,2.24 51.1,14.3 49.4,16 46.3,16 43.97,18.33 42.65,18.33 v41.97,17.65
  Bottom 0.152: v41.97,17.65 41.97,17.05 41.74,16.82 36.08,16.82 35.45,17.45 JMP2.P$3
PROG
  Top 0.152: U2.5 23.55,10.4 R12.2
PS_EN  (via drill 0.25)
  Top 0.152: U3.6 14.47,7.25 14.25,7.47 v14.25,8.88
  Route2 0.152: v14.25,8.88 12.41,8.88 9.54,6.02 v6.65,6.02
  Bottom 0.152: R5.1 14.8,8.2 14.25,8.74 v14.25,8.88 | Q5.3 6.92,6.02 v6.65,6.02
PS_EN_CC
  Bottom 0.152: 13.07,7.05 12.74,7.05 12.29,7.5 12.29,8.02 11.96,8.35 U9.3 10.38,8.35 | U9.6 14.9,7.05 R5.2
  Bottom 0.2: R2.2 10.38,8.35 | U9.3 11.71,8.29 11.83,8.29 | 13.07,7.05 U9.6
RTC_INT
  Top 0.152: U8.4 26.27,18.6 26.08,18.41 26.08,17.38 Q1.1 28.72,17 R6.1
RTC_PS_EN  (via drill 0.25)
  Top 0.152: Q1.3 25.97,16.5 v25.77,16.7
  Bottom 0.152: v25.77,16.7 25.12,16.7 23.5,15.08 23.5,9.68 22.4,8.58 15.71,8.58 14.91,9.38 13.38,9.38 12.63,8.63 12.63,7.9 12.83,7.7 U9.5
SIM_CLK  (via drill 0.25)
  Top 0.152: U1.46 48.37,5.7 v48.32,5.7
  Bottom 0.152: v48.32,5.7 v48.32,5.69 48.74,5.27 49.79,5.27 50.64,6.12 50.64,10.74 47.8,13.58 44.36,13.58 43.45,14.49 35.21,14.49 34.44,15.26 31.14,15.26 27.43,18.96 20.98,18.96 20.7,19.25 18.15,19.25 17.23,18.33 J6.S3 8.12,18.33 7.57,17.78 TP3.TP
SIM_IO  (via drill 0.25)
  Top 0.152: U1.48 49.37,5.75 v49.42,5.7
  Bottom 0.152: v49.42,5.7 49.83,5.7 50.36,6.24 50.36,10.63 47.69,13.3 44.24,13.3 43.33,14.21 34.45,14.21 34.44,14.2 31.8,14.2 27.32,18.69 20.86,18.69 20.58,18.97 18.27,18.97 15.23,15.93 J6.S6 8.16,15.93 6.72,14.49 TP6.TP
SIM_RST  (via drill 0.25)
  Top 0.152: v46.82,5.7 46.87,5.75 U1.43
  Bottom 0.152: v46.82,5.7 47.39,6.27 47.39,7.21 46.34,8.26 42,8.26 40.46,9.8 38.43,9.8 37.98,9.35 37.91,9.35 TP4.TP 37.73,9.17 37.1,9.8 33.95,9.8 32.13,11.62 32.13,12.87 27.02,17.97 20.02,17.97 19.18,17.13 J6.S2
SIM_VCC  (via drill 0.25)
  Top 0.152: v49.72,7.13 49.72,7.08
  Top 0.305: U1.49 49.87,6.93 49.72,7.08
  Bottom 0.305: J6.S1 27.17,18.33 32.55,12.95 32.55,11.76 34.09,10.22 40.39,10.22 TP5.TP 40.67,10.15 42.14,8.68 48.17,8.68 v49.72,7.13
SWCLK  (via drill 0.25)
  Top 0.152: 41.87,5.53 U1.33 | 41.87,5.53 41.79,5.45 v41.77,5.45 41.85,5.53 41.87,5.53 | J8.4 9.3,6.43 8.33,5.46 8.03,5.46 7.14,4.57 7.14,2.84 7.43,2.55 7.43,1.97 v7.21,1.75
  Route2 0.152: v49.3,13.86 v49.29,13.87 49.29,13.73 48.26,12.7 42.8,12.7 41.92,11.82 41.92,5.6 v41.77,5.45 41.28,5.45 40.29,6.44 35.19,6.44 33.36,8.27 22.27,8.27 18.87,4.87 9.42,4.87 7.42,2.87 6.82,2.87 6.43,2.48 6.43,2.19 6.87,1.75 v7.21,1.75
  Bottom 0.152: v49.29,13.87 49.29,13.31 50.2,12.4 TP2.TP
SWDIO  (via drill 0.25)
  Top 0.152: U1.34 42.37,4.6 v42.52,4.45 | J8.2 8.03,5.86 6.79,4.62 6.79,2.58 v7,2.37
  Route2 0.152: v49.9,13.87 48.45,12.42 42.92,12.42 42.21,11.71 42.21,5.39 42.52,5.08 v42.52,4.45 v42.51,4.46 41.87,4.46 40.17,6.16 35.07,6.16 33.24,7.99 22.38,7.99 18.99,4.59 9.55,4.59 7.32,2.37 v7,2.37
  Bottom 0.15: TP1.TP 51.03,14.3 50.77,14.05
  Bottom 0.152: v49.9,13.87 50.6,13.87 50.77,14.05
VBAT  (via drill 0.25)
  Top 0.152: v33.14,18.85 33.12,18.83 Q2.4 33.15,18.14 R10.2
  Top 1.016: Q3.3 23.22,21.23 23.58,21.59 J2.1
  Route2 0.61: v20.02,16.11 20.02,17.26
  Route2 1.27: 20.02,15.96 20.02,17.26 24.13,21.37 J2.1
  Bottom 0.152: v33.14,18.85 33.09,18.9 31.1,18.9 30.1,19.9 25.82,19.9 J2.1
  other vias: 20.05,17.16 20.02,16.61 20.02,15.61
  pour Top (no thermals): 18.39,17.89 18.39,13.47 20.22,13.47 21.32,12.37 21.76,12.37 21.76,13.52 21.56,13.72 21.56,15.62 19.29,17.89
  pour Route2 (no thermals): 19.66,16.44 19.85,15.61 20.15,16.44
VBUS  (via drill 0.25)
  Top 0.152: 22.32,9.78 v22.3,9.8 | v21.9,16.95 21.45,16.95 v21.4,17 | R15.2 28.9,3.1 28.27,3.73 C14.1 | D6.A 9.65,10.05
  Top 0.406: 22.27,14.3 Q3.1 | 26.28,4.02 C13.1
  Top 0.508: J1.VBUS1 8.28,13.88
  Top 0.55: 26.28,4.02 25.6,4.7 23,4.7 22.32,5.38 C11.1 22.32,9.78
  Top 0.61: J1.VBUS2 7.21,8.98 7.22,8.97 8.18,8.97 8.57,8.97 v8.86,9.26 | D6.A D5.A
  Top 0.68: D5.A 9.65,10.05 v8.86,9.26
  Top 1.016: 9.3,13.9 11.25,13.9 16.25,18.9 19.55,18.9 21.83,16.62
  Bottom 0.152: v22.3,9.8 22.3,9.9 22.2,10 | v8.86,9.26 8.86,9.04 8.98,8.91 R7.2 9.38,8.29 9.97,7.7 U9.2
  Bottom 1.016: v21.4,17 v21.4,16.99 22.2,16.19 22.2,10
  other vias: 21.6,16.55 22.2,10.9 22.4,10.4
  pour Top (no thermals): 9.39,12.41 8.1,13.7 6.7,13.7 7.29,14.33 10.26,14.33 10.57,13.62 9.91,12.96 9.91,11.75 9.39,11.75
  pour Top (no thermals): 21.34,16.5 21.93,15.91 21.93,13.8 22.6,13.8 22.6,16.46 22.16,16.9 21.75,16.9
  pour Top (no thermals): 21.82,9.78 21.34,9.78 21.34,10.83 21.63,10.83 22,11.2 22.4,11.2 22.7,10.9 22.7,9.7 22.5,9.5 22.1,9.5
  pour Top (no thermals): 25.9,3.8 25.9,2.9 26.6,2.9 27.2,3.5 27.9,3.5 27.9,4.3 27.79,4.41 27.79,5.2 27.66,5.2 27.66,4.93 27.23,4.5 26.6,4.5
VCC_5V0  (via drill 0.25)
  Route2 1.27: J2.3 28.97,21.6 19.67,12.3 11.08,12.3 v10.98,12.2
  other vias: 10.68,12.6 11.28,12.6 11.28,11.8 10.68,11.8
  pour Top (no thermals): 12.88,11.6 12.88,12.8 10.44,12.8 10.44,11.5 11.98,11.5 12.08,11.6
  pour Route2 (no thermals): 10.22,12.5 10.22,11.9 10.52,11.6 11.37,11.6 11.82,12.05 11.82,12.4 11.32,12.9 10.62,12.9
VSYS  (via drill 0.25)
  Top 0.152: 29.47,20.1 U8.10 30.2,20.1 C17.1 30.84,20.08 v31.02,19.9 | v30.76,16.27 30.74,16.25 30.57,16.25 R6.2 | SW2.2 v18.4,4.04 SW2.1 17.39,4.1
  Route2 0.152: v31.02,19.9 30.67,19.55 29.97,19.55 25.97,15.55 25.92,15.55 | v30.76,16.27 30.74,16.25 27.42,16.25 26.72,15.55 v26.62,15.45
  Route2 0.508: v15.59,5.92 v15.59,6.47 15.59,10.85 15.54,10.9
  Route2 1.27: v11.22,10 11.32,10 12.22,10.9 15.54,10.9 20.32,10.9 24.97,15.55 25.92,15.55 26.72,15.55
  Route15 0.152: v18.4,4.04 17.99,4.04 17.47,4.04 v15.59,5.92
  Bottom 0.152: v31.02,19.9 31.64,19.28 33.32,19.28 33.57,19.03 33.57,18.67 33.32,18.42 33.12,18.42 32.8,18.1 32.8,17.48 JMP2.P$1
  other vias: 11.22,10.5 10.72,10.1 11.42,9.5 10.72,10.6 25.17,15.95 25.47,15.55 25.17,15.15 25.77,15.95 26.07,15.55 25.77,15.15 26.27,15.05 10.92,9.6 24.82,15.55
  pour Top (no thermals): 14.4,9.22 10.52,9.22 10.52,10.9 14.22,10.9 14.4,10.72
  pour Top (no thermals): 26.62,16.15 24.72,16.15 23.72,15.15 23.72,13.8 24.62,13.8 24.62,14.6 24.82,14.8 24.92,14.85 26.47,14.85 26.92,15.3 26.92,15.85
  pour Top (no thermals): 15.17,6.8 14.57,6.8 14.57,6.15
  pour Route2 (no thermals): 11.6,10.88 10.7,10.88 10.5,10.68 10.5,9.58 10.8,9.28 11.5,9.28 12.55,10.33 12.4,10.48 12,10.48
  pour Top (no thermals): 14.9,9.22 14.31,9.22 14.31,10.27 14.33,10.27 14.9,9.7
  pour Top (no thermals): 15.21,5.99 14.54,5.99 14.54,6.47 14.57,6.5 14.86,6.5 15.26,6.9 15.26,7.46 15.27,7.47 15.88,7.47 15.88,5.88 15.76,5.76 15.44,5.76

## Text on the board
Bottom: V1
bPlace: Designed By | Y | Z | X
Document: nRF9160 Thing Plus | Notes: / / * T4 solder paste / * Lead Free assembly / * Measures in mm | Sparkfun
tDocu: TOP
bDocu: BOT | (Top down)